# EAGLE design Buzzwad_Buoy_Faith_DEA (EAGLE 9.6.2)
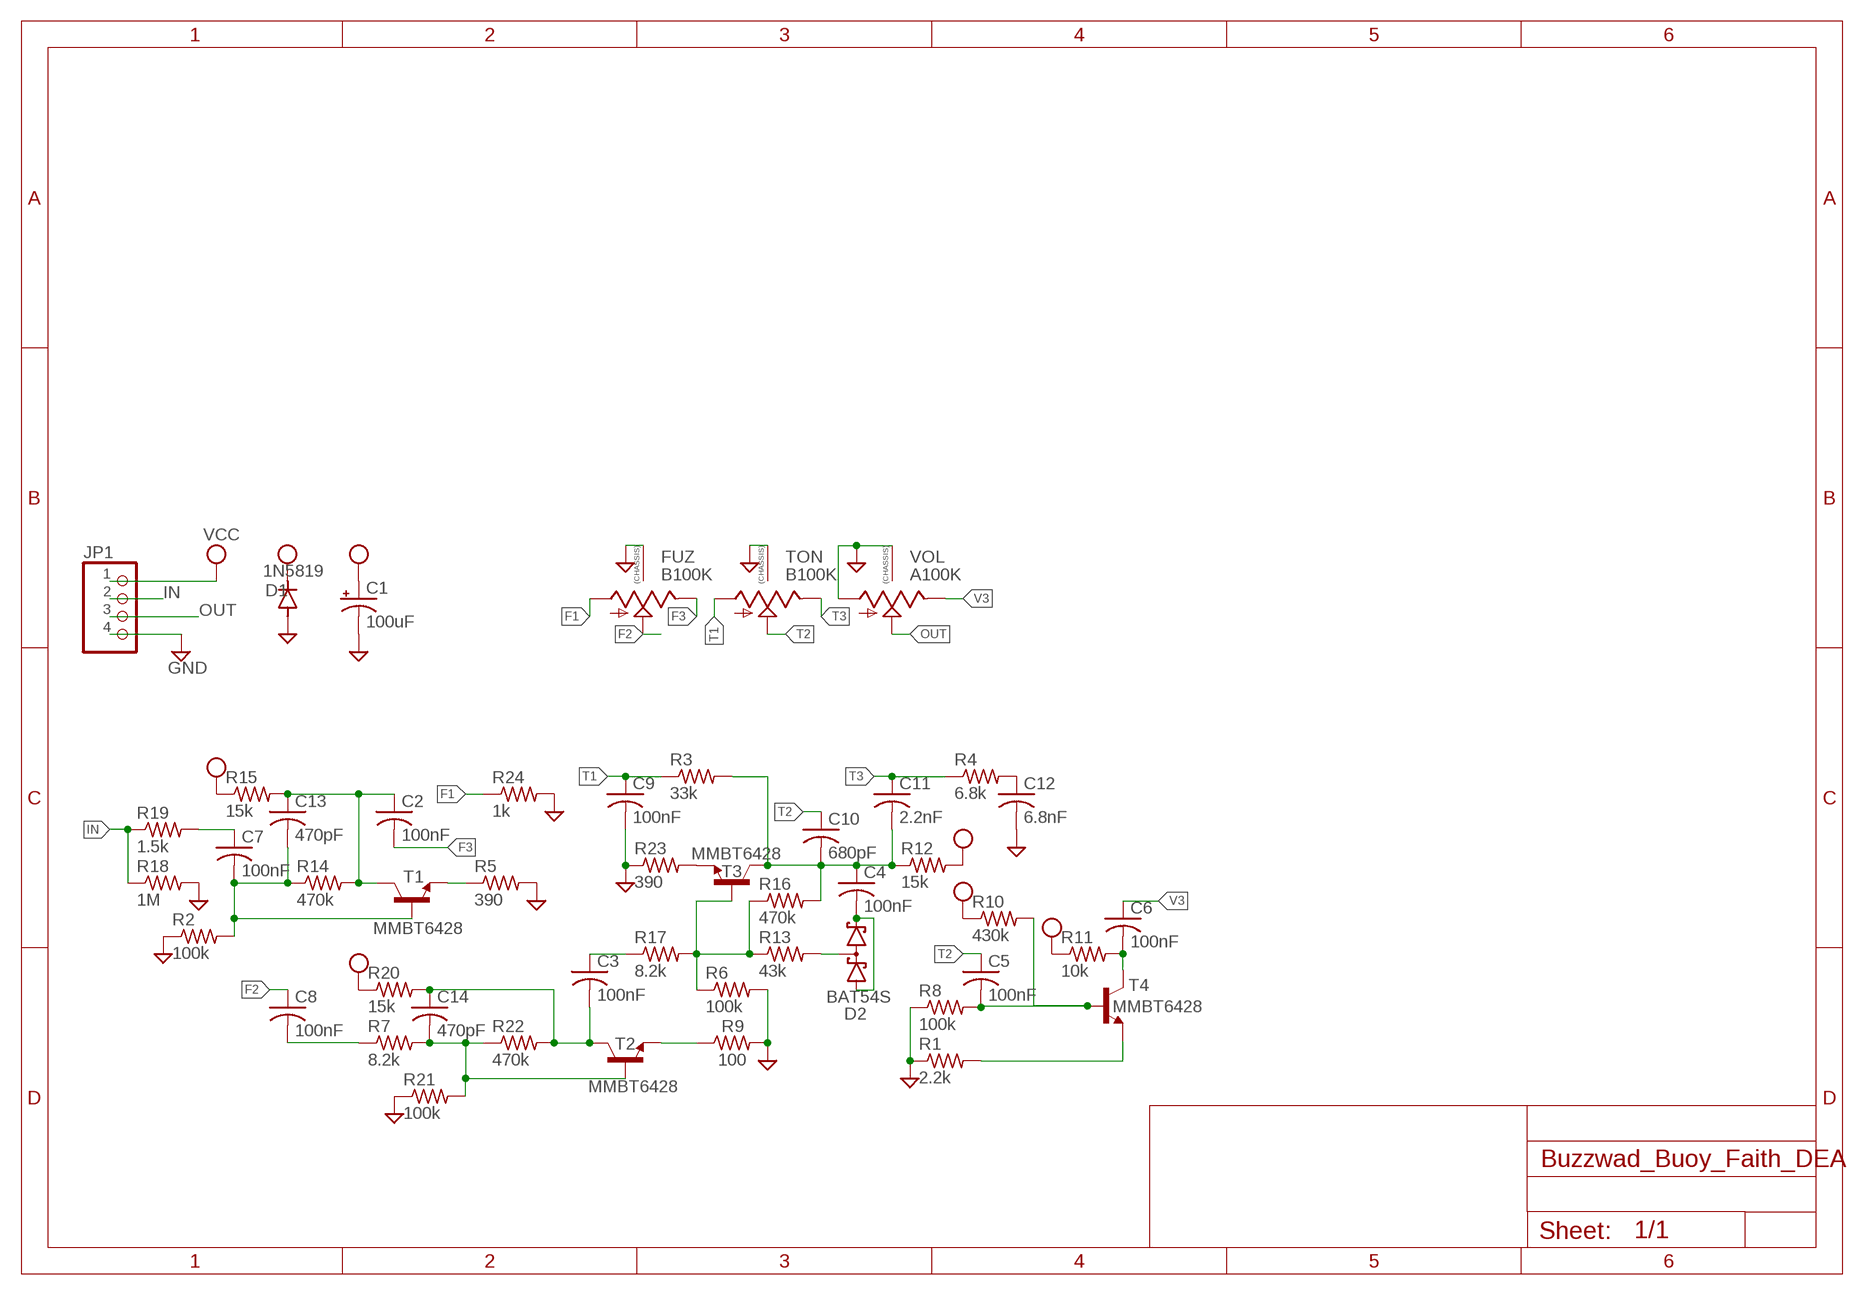
[diagram p0: schematic, sheet 1]

## Parts
C1  100uF  CAP_SMD+THRUPAN_B  [PAN_B_SMD+THRU]
C2  100nF  C-USC0402  [C0402]
C3  100nF  C-USC0402  [C0402]
C4  100nF  C-USC0402  [C0402]
C5  100nF  C-USC0402  [C0402]
C6  100nF  C-USC0402  [C0402]
C7  100nF  C-USC0402  [C0402]
C8  100nF  C-USC0402  [C0402]
C9  100nF  C-USC0402  [C0402]
C10  680pF  C-USC0402  [C0402]
C11  2.2nF  C-USC0402  [C0402]
C12  6.8nF  C-USC0402  [C0402]
C13  470pF  C-USC0402  [C0402]
C14  470pF  C-USC0402  [C0402]
D1  1N5819  DIODE-SOD123  [SOD123]
D2  BAT54S  [SOT23]
FUZ  B100K  9MM_SNAP-IN_POT_CHASSIS  [9MM_SNAP-IN_POT]
JP1  PINHD-1X4  [1X04]
R1  2.2k  R-US_R0402  [R0402]
R2  100k  R-US_R0402  [R0402]
R3  33k  R-US_R0402  [R0402]
R4  6.8k  R-US_R0402  [R0402]
R5  390  R-US_R0402  [R0402]
R6  100k  R-US_R0402  [R0402]
R7  8.2k  R-US_R0402  [R0402]
R8  100k  R-US_R0402  [R0402]
R9  100  R-US_R0402  [R0402]
R10  430k  R-US_R0402  [R0402]
R11  10k  R-US_R0402  [R0402]
R12  15k  R-US_R0402  [R0402]
R13  43k  R-US_R0402  [R0402]
R14  470k  R-US_R0402  [R0402]
R15  15k  R-US_R0402  [R0402]
R16  470k  R-US_R0402  [R0402]
R17  8.2k  R-US_R0402  [R0402]
R18  1M  R-US_R0402  [R0402]
R19  1.5k  R-US_R0402  [R0402]
R20  15k  R-US_R0402  [R0402]
R21  100k  R-US_R0402  [R0402]
R22  470k  R-US_R0402  [R0402]
R23  390  R-US_R0402  [R0402]
R24  1k  R-US_R0402  [R0402]
T1  MMBT6428  BC808-NPN-SOT23-BEC  [SOT23-BEC]
T2  MMBT6428  BC808-NPN-SOT23-BEC  [SOT23-BEC]
T3  MMBT6428  BC808-NPN-SOT23-BEC  [SOT23-BEC]
T4  MMBT6428  BC808-NPN-SOT23-BEC  [SOT23-BEC]
TON  B100K  9MM_SNAP-IN_POT_CHASSIS  [9MM_SNAP-IN_POT]
VOL  A100K  9MM_SNAP-IN_POT_CHASSIS  [9MM_SNAP-IN_POT]

## Nets
F1: FUZ.1(A) R24.1
F2: C8.1 FUZ.2(S)
F3: C2.2 FUZ.3(E)
GND: C1.- C1.--(-) C9.2 C12.2 D1.A FUZ.CHASSIS1 FUZ.CHASSIS2 JP1.4 R1.1 R2.1 R5.2 R6.2 R8.1 R9.2 R18.2 R21.1 R23.1 R24.2 TON.CHASSIS1 TON.CHASSIS2 VOL.1(A) VOL.CHASSIS1 VOL.CHASSIS2
IN: JP1.2 R18.1 R19.1
N$1: C14.2 R7.2 R21.2 R22.1 T2.B
N$2: C7.1 R19.2
N$3: C7.2 C13.2 R2.2 R14.1 T1.B
N$4: C2.1 C13.1 R14.2 R15.2 T1.C
N$5: R5.1 T1.E
N$6: C3.2 C14.1 R20.2 R22.2 T2.C
N$7: R9.1 T2.E
N$8: C3.1 R17.1
N$9: R6.1 R13.1 R16.1 R17.2 T3.B
N$10: D2.3(C1A2) R13.2
N$11: C4.2 D2.1(A1) D2.2(C2)
N$12: R23.2 T3.E
N$13: C4.1 C10.2 C11.2 R3.2 R12.1 R16.2 T3.C
N$14: C12.1 R4.2
N$15: C5.2 R8.2 R10.2 T4.B
N$16: C6.2 R11.2 T4.C
N$17: R1.2 T4.E
N$18: C8.2 R7.1
OUT: JP1.3 VOL.2(S)
T1: C9.1 R3.1 TON.1(A)
T2: C5.1 C10.1 TON.2(S)
T3: C11.1 R4.1 TON.3(E)
V3: C6.1 VOL.3(E)
VCC: C1.+ C1.++(+) D1.C JP1.1 R10.1 R11.1 R12.2 R15.1 R20.1

## Library data of the parts
C1 = MusicThingModular:CAP_SMD+THRU
C2-C14 = adafruit:C-US: CAPACITOR, American symbol
D1 = diode:DIODE-: DIODE
D2 = diode:BAT54S: Schottky Diodes Pin connection corrected 2011-05-04 Source: Fairchild .. BAT54.pdf
FUZ TON VOL = MusicThingModular:9MM_SNAP-IN_POT_CHASSIS: 9mm vertical snap-in pot, Alpha / Panasonic style, with a connection to the metal chassis for grounding
JP1 = Connector:PINHD-1X4: PIN HEADER; CATEGORY: CONNECTOR; SUB-CATEGORY: PIN-HEADER
R1-R24 = adafruit:R-US_: RESISTOR, American symbol
T1-T4 = MusicThingModular:*-NPN-: NPN Transistror BF959 corrected 2008.03.06

## Board
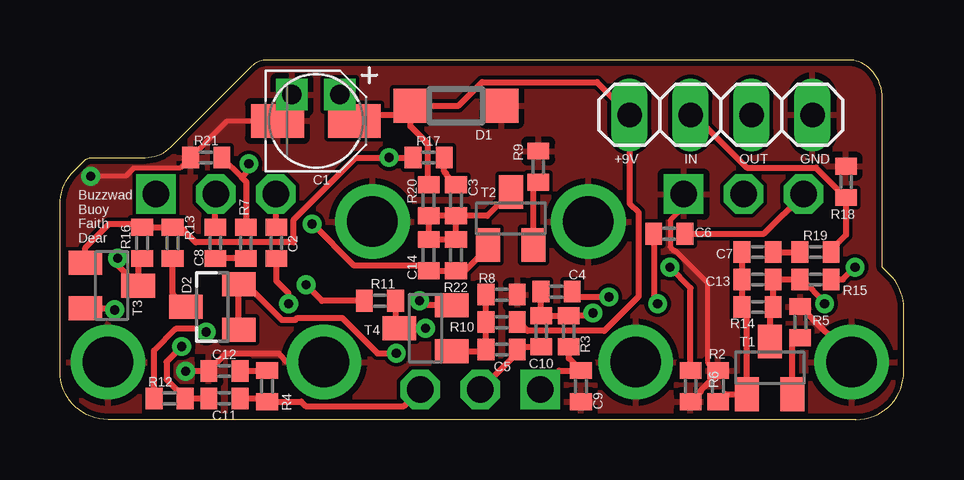
[diagram p1: board, top side]
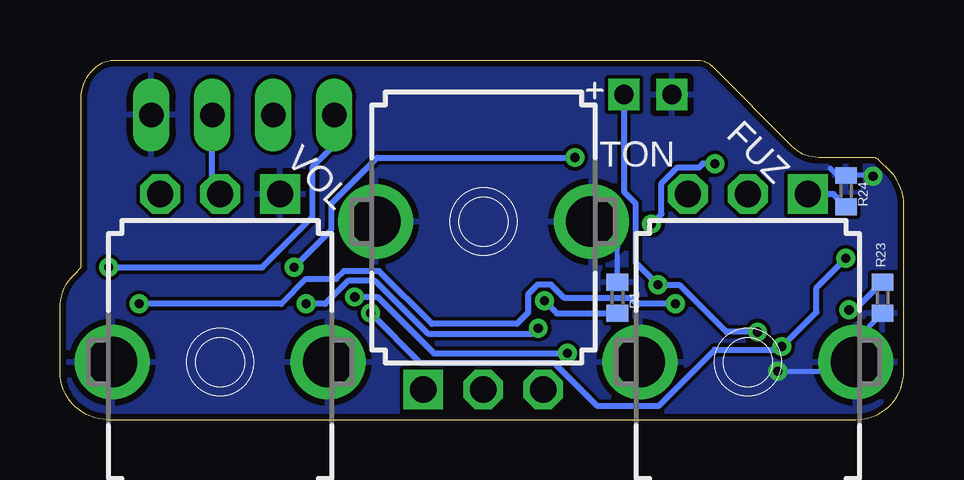
[diagram p2: board, bottom side, seen from below]

Size 35.18 x 14.99 mm. Coordinates in mm from the lower left corner, seen from the top.
Outline: 33.18,0 2,0 arc-90 0,2 0,8.95 arc-45 0.59,10.37 1.02,10.79 arc-45 1.32,10.92 3.56,10.92 arc45 4.64,11.37 7.99,14.72 arc-45 8.64,14.99 32.86,14.99 arc-45 33.78,14.61 arc-45 34.29,13.38 34.29,6.35 34.59,6.05 arc-45 35.18,4.63 35.18,2 arc-90 33.18,0
Copper layers (1*16): Top 0.035mm / dielectric 1.5mm / Bottom 0.035mm
Design rules "default *": minimum track width 6mil, minimum drill 0.35mm, track to track 6mil, track to pad 6mil, pad to pad 6mil, via to via 6mil, smd to smd 6mil, copper to edge 10mil, drill to drill 6mil, minimum pad ring 10mil, minimum via ring 8mil, stop-mask expansion 4mil, vias tented up to drill 0mil, thermal gap 10mil

### Footprints (pad centres in the part's own frame; a part is rotated, then mirrored left to right if it is on the bottom)
PAN_B_SMD+THRU = smd 2.2 x 1.4: + 1.6,0; - -1.6,0 | drill 0.8 pad 0.9 square: ++ 1,1.1; -- -1,1.1
C0402 = smd 0.7 x 0.9: 1 -0.65,0; 2 0.65,0
SOD123 = smd 1.4 x 1.4: A 1.9,0; C -1.9,0
SOT23 = smd 1 x 1.4: 1 -0.95,-1.1; 2 0.95,-1.1; 3 0,1.1
9MM_SNAP-IN_POT = drill 1.1 square: 1 -2.5,-7 | drill 1.1 octagon: 2 0,-7; 3 2.5,-7 | drill 2.1 pad 2.794: CHASSIS1 -4.5,0; CHASSIS2 4.5,0
1X04 = drill 1.016 long: 1 -3.81,0; 2 -1.27,0; 3 1.27,0; 4 3.81,0
R0402 = smd 0.7 x 0.9: 1 -0.65,0; 2 0.65,0
SOT23-BEC = smd 1 x 1.4: B -0.95,-1.1; C 0,1.1; E 0.95,-1.1

### Placement (x,y rotation side)
C1  10.67,12.45 0 top
C2  9.02,7.37 90 top
C3  16.51,9.14 270 top
C4  20.7,5.33 0 top
C5  18.41,2.92 180 top
C6  25.4,7.75 180 top
C7  29.08,6.99 180 top
C8  6.48,7.37 270 top
C9  21.72,1.4 270 top
C10  20.07,3.68 90 top
C11  6.86,0.89 180 top
C12  6.86,2.03 180 top
C13  29.08,5.84 180 top
C14  15.37,6.86 270 top
D1  16.51,13.08 0 top
D2  6.35,4.7 90 top
FUZ  6.5,2.4 180 bottom
JP1  27.56,12.7 0 top
R1  11.94,5.08 270 bottom
R2  27.43,1.4 270 top
R3  21.21,3.68 90 top
R4  8.64,1.4 90 top
R5  30.86,4.06 90 top
R6  26.29,1.4 270 top
R7  7.75,7.37 90 top
R8  18.41,5.21 180 top
R9  19.94,10.54 90 top
R10  18.41,4.06 180 top
R11  13.34,4.95 0 top
R12  4.57,0.89 180 top
R13  4.7,7.37 270 top
R14  29.08,4.7 0 top
R15  31.5,5.84 180 top
R16  3.43,7.37 270 top
R17  15.37,10.92 180 top
R18  32.77,9.91 90 top
R19  31.5,6.99 180 top
R20  15.37,9.14 270 top
R21  6.1,10.92 0 top
R22  16.51,6.86 90 top
R23  0.89,5.08 90 bottom
R24  2.41,9.53 90 bottom
T1  29.59,2.16 0 top
T2  18.8,8.38 0 top
T3  2.16,5.59 270 top
T4  15.24,3.81 90 top
TON  17.53,8.26 0 bottom
VOL  28.5,2.4 180 bottom

### Tracks (layer width: path | path; a pad name or v marks a point on that pad's centre or on a via)
F1
  Bottom 0.254: R24.1 2.94,9.4 FUZ.1
F2
  Top 0.254: C8.1 6.48,9.38 FUZ.2
F3
  Top 0.254: C2.2 9,8.03 FUZ.3
GND  (via drill 0.38)
  Top 0.203: 27.43,1.94 26.99,2.38 26.99,5.7 25.65,7.04 25.59,7.04 25.45,7.19 25.45,8.3 26,8.86 | v1.28,10.15 2.74,10.15 3.07,10.48 5,10.48 R21.1 6.97,12.45 C1.-
  Top 0.254: 22.03,7.55 TON.CHASSIS1 | FUZ.CHASSIS2 9.48,2.4 9.12,2.76 6.94,2.76 C12.2 6.19,2.01 v5.25,2.01 | R5.2 33,2.58 VOL.CHASSIS2 | R6.2 26.7,1.16 26.7,1.21 27.43,1.94 R2.1
  Bottom 0.152: 2.54,10.18 2.8,10.18
  Bottom 0.203: 2.54,10.18 2.77,10.18 3.07,10.48 | R1.1 11.94,7.17 TON.CHASSIS2 | v5.25,2.01 2.39,2.01 2.2,2.2 | R23.1 2,3.32 FUZ.CHASSIS1 | v1.28,10.15 1.31,10.18 R24.2
  pour Bottom (isolate 0.127): -1.27,15.24 -1.27,0 36.83,0 36.83,15.24
  pour Top (isolate 0.127): -1.27,15.24 -1.27,0 36.83,0 36.83,15.24
IN
  Top 0.254: JP1.2 26.43,12.7 28.63,10.5 31.52,10.5 R18.1 32.77,7.69 32.1,7.03 R19.1
N$1  (via drill 0.38)
  Top 0.254: T2.B 17.85,7.16 16.89,6.21 R22.1 C14.2 15.16,6.42 12.27,6.42 v10.53,8.15 v10.52,8.15 | R7.2 7.76,8.03 7.76,9.91 7.56,10.1 | R21.2 7.56,10.1 | 7.56,10.1 7.87,10.41 v7.87,10.67
  Bottom 0.254: v10.52,8.15 10.1,8.56 10.1,9.86 9.46,10.5 8.54,10.5 8.38,10.67 v7.87,10.67
N$2
  Top 0.254: C7.1 R19.2
N$3
  Top 0.254: C7.2 C13.2 R14.1 28.64,4.49 T1.B 27.74,1.06 R2.2
N$4  (via drill 0.38)
  Top 0.254: v9.52,4.83 9.52,5.27 9.02,5.78 C2.1 | T1.C 29.59,4.56 R14.2 C13.1 R15.2 30.93,5.84 31.91,4.86 v31.88,4.83
  Bottom 0.254: v31.88,4.83 25.95,4.83 24.91,5.86 23.66,5.86 23.34,6.19 21.87,6.19 19.67,3.99 16.13,3.99 15.66,4.46 15.66,5.23 15.27,5.63 14.71,5.63 14.14,5.06 11.37,5.06 11.14,4.83 v9.52,4.83
N$5
  Top 0.254: T1.E 30.54,3.09 R5.1
N$6
  Top 0.254: T2.C 17.81,8.49 C3.2 | C3.2 R22.2 C14.1 R20.2 C3.2
N$7
  Top 0.254: T2.E 19.75,9.7 R9.1
N$8
  Top 0.254: C3.1 16.1,10.21 16.1,10.26 16.02,10.34 R17.1
N$9  (via drill 0.38)
  Top 0.254: R17.2 v13.72,10.92 12.33,10.92 9.75,8.34 9.75,7.39 5.66,7.39 5.03,8.02 R13.1 R16.1 3.3,8.14 2.03,8.14 1.06,7.17 T3.B | R6.1 26.29,5.48 v25.42,6.35
  Bottom 0.254: v25.42,6.35 23.86,7.91 23.86,9.02 21.96,10.92 v13.72,10.92
N$10
  Top 0.254: D2.3 4.7,5.25 R13.2
N$11  (via drill 0.38)
  Top 0.254: D2.1 D2.2 7.75,5.65 9.25,4.15 9.8,4.15 9.89,4.24 11.76,4.24 13.23,2.76 v14.02,2.76 | v22.89,5.11 22.51,5.11 22.5,5.12 21.57,5.12 C4.2
  Bottom 0.254: v14.02,2.76 14.4,2.76 14.4,2.77 19.59,2.77 21.95,5.12 22.5,5.12 22.51,5.11 v22.89,5.11
N$12  (via drill 0.38)
  Top 0.254: T3.E 2.22,4.64 v2.29,4.57
  Bottom 0.254: v2.29,4.57 2.05,4.57 R23.2
N$13  (via drill 0.38)
  Top 0.254: C4.1 20.05,4.35 C10.2 R3.2 22.11,4.33 v22.23,4.45 | C11.2 R12.1 4.45,1.67 4.45,2.41 v5.08,3.05 | R16.2 3.26,6.55 T3.C 2.41,6.43 v2.41,6.73
  Bottom 0.254: v22.23,4.45 20.14,2.36 14.57,2.36 12.77,0.56 10.24,0.56 7.88,2.92 5.21,2.92 v5.08,3.05 3.65,4.48 3.65,5.5 v2.41,6.73
N$14
  Top 0.254: C12.1 7.52,2.05 R4.2
N$15
  Top 0.254: T4.B 17.7,2.86 C5.2 R10.2 R8.2
N$16  (via drill 0.38)
  Top 0.254: R11.2 13.98,3.96 T4.C v15.24,3.81 | C6.2 24.75,4.99 v24.92,4.83
  Bottom 0.254: v15.24,3.81 15.46,3.59 19.84,3.59 22.04,5.78 23.17,5.78 24.12,4.83 v24.92,4.83
N$17  (via drill 0.38)
  Top 0.254: T4.E 15.18,4.76 v14.99,4.95
  Bottom 0.254: v14.99,4.95 14.46,4.43 R1.2
N$18
  Top 0.254: R7.1 C8.2
OUT
  Bottom 0.254: VOL.2 28.83,9.73 JP1.3
T1
  Top 0.254: TON.1 20.82,2.05 C9.1 21.21,2.56 R3.1
T2
  Top 0.254: TON.2 19.07,2.79 C5.1 19.18,3.03 C10.1
T3
  Top 0.254: C11.1 8.49,0.89 R4.1 10.05,0.75 10.24,0.56 14.33,0.56 TON.3
V3
  Top 0.254: C6.1 29.35,7.75 VOL.3
VCC  (via drill 0.38)
  Top 0.254: R20.1 15.35,9.81 15.35,11.49 14.61,12.22 14.61,12.7 | 14.61,12.7 D1.C 16.61,13.08 17.59,14.06 22.39,14.06 JP1.1 23.75,9 24.12,8.63 24.12,5.13 22.69,3.7 19.5,3.7 19.14,4.06 R10.1 | 14.61,12.7 12.52,12.7 C1.+ 11.67,13.05 C1.++ | R12.2 3.92,2.88 4.83,3.78 5.97,3.78 v6.1,3.65 | R11.1 10.92,4.95 v10.26,5.62 | R15.1 32.64,5.84 v33.15,6.35
  Bottom 0.254: v6.1,3.65 7.4,3.65 9.37,5.62 v10.26,5.62 11.19,6.55 11.19,9.02 11.67,9.49 C1.++ | v33.15,6.35 26.75,6.35 24.65,8.45 24.65,10.53 23.75,11.43 JP1.1

### Text on the board
tPlace: +9V | IN | OUT | GND | Buzzwad / Buoy / Faith / Dear